# Altium project power_regulator.PrjPcb
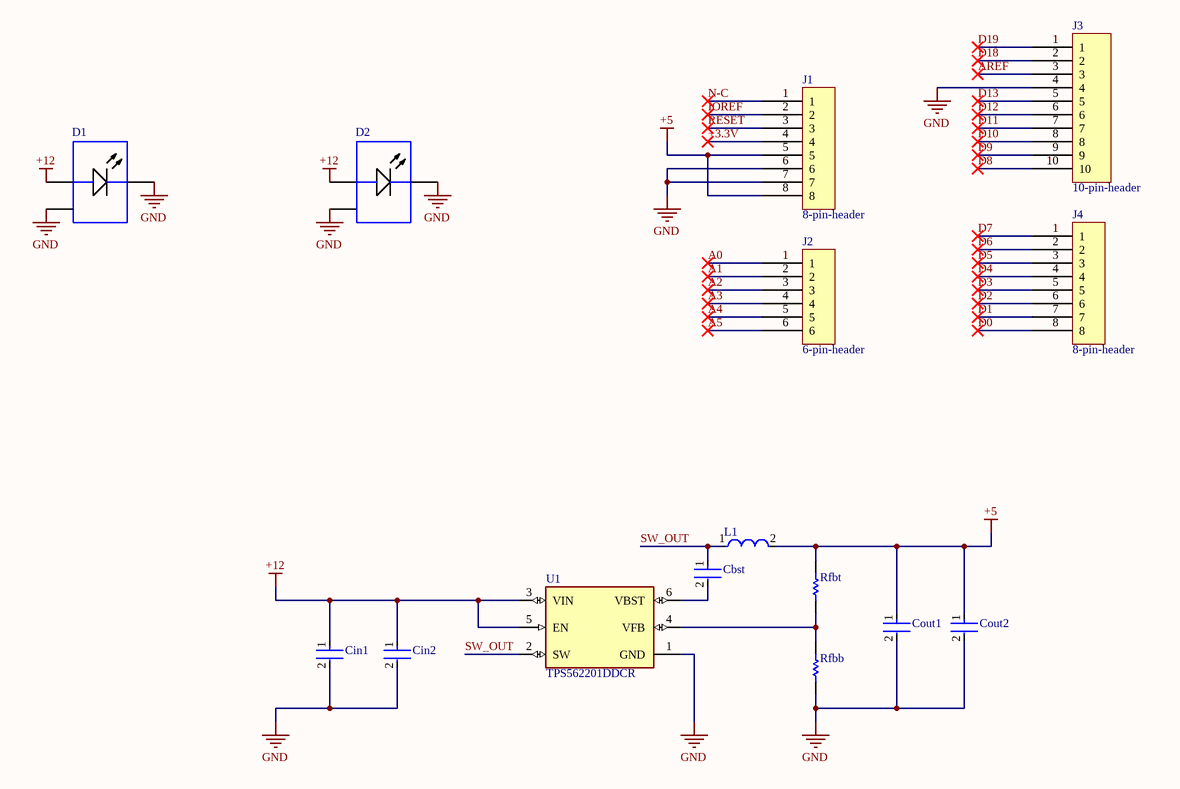
[diagram p0: Sheet1.SchDoc]
1 sheet, 15 parts. Net scope: global (net labels, ports and power ports of the same name join across sheets).
Board file: PCB1.PcbDoc

## Sheet Sheet1.SchDoc
size A4; DrawnBy: Ashok T; SheetNumber: 1; SheetTotal: 1

### Parts
Cbst  CL10B104KA8NFNC  [FP-CL10-IPC_C]  (value not drawn)
Cin1  CL21A106MPFNNNF  [FP-CL21-IPC_C]  (value not drawn)
Cin2  CL21A106MPFNNNF  [FP-CL21-IPC_C]  (value not drawn)
Cout1  12066D226MAT2A  [FP-1206-L_3_2_0_2-W_1_6_0-IPC_C]  (value not drawn)
Cout2  12066D226MAT2A  [FP-1206-L_3_2_0_2-W_1_6_0-IPC_C]  (value not drawn)
D1  MKRAWT-00-0000-0D0BJ20E5  [CREE-MK-R-2_V]  (value not drawn)
D2  MKRAWT-00-0000-0D0BJ20E5  [CREE-MK-R-2_V]  (value not drawn)
J1  8-pin-header  [8-pin-header-Footprint-1]
J2  6-pin-header  [6-pin-header-Footprint-1]
J3  10-pin-header  [10-pin-header-Footprint-1]
J4  8-pin-header  [8-pin-header-Footprint-1]
L1  NRS8030T3R3MJGJ  [FP-NRS8030-MFG]  (value not drawn)
Rfbb  ERJ2RKF1002X  [RESC1005X40X25LL05T05]  (value not drawn)
Rfbt  ERJ-2RKF5622X  [RESC1005X40X25LL05T05]  (value not drawn)
U1  TPS562201DDCR  [FP-DDC0006A-IPC_C]

### Nets
+5: Cout1.1 Cout2.1 J1.5 J1.8 L1.2 Rfbt.2
+12: Cin1.1 Cin2.1 D1.1(A) D2.1(A) U1.3(VIN) U1.5(EN)
GND: Cin1.2 Cin2.2 Cout1.2 Cout2.2 D1.2(K) D1.3(EP) D2.2(K) D2.3(EP) J1.6 J1.7 J3.4 Rfbb.1 U1.1(GND)
+3.3V: J1.4
A0: J2.1
A1: J2.2
A2: J2.3
A3: J2.4
A4: J2.5
A5: J2.6
AREF: J3.3
D0: J4.8
D1: J4.7
D2: J4.6
D3: J4.5
D4: J4.4
D5: J4.3
D6: J4.2
D7: J4.1
D8: J3.10
D9: J3.9
D10: J3.8
D11: J3.7
D12: J3.6
D13: J3.5
D18: J3.2
D19: J3.1
IOREF: J1.2
N-C: J1.1
RESET: J1.3
SW_OUT: Cbst.1 L1.1 U1.2(SW)
NetCbst_2: Cbst.2 U1.6(VBST)
NetRfbb_2: Rfbb.2 Rfbt.1 U1.4(VFB)

### Library data of the parts
Cbst = CMP-13271-001423-1: Cap Ceramic 100nF 25V X7R ±10% Pad SMD 0603 +125°C T/R; Depth: 0.8mm; Tolerance: 10%; Case Code (Imperial): 0603; Max Operating Temperature: 125°C; Min Operating Temperature: -55°C; Dielectric: X7R; Width: 0.031inch; Thickness: 0.035inch; Height: 0.8mm; Length: 1.6mm; Mount: Surface Mount; Capacitance: 100nF; Voltage Rating: 25V; Case Code (Metric): 1608; Case/Package: 0603; Radiation Hardening: No; Packaging: Tape and Reel
Cin1 Cin2 = CMP-13271-002245-1: CL21 Series 0805 10uF 10V ±20% Tolerance X5R Multilayer Ceramic Chip Capacitor; Voltage Rating (DC): 10V; Mount: Surface Mount; Tolerance: 20%; Case/Package: 0805; Voltage Rating: 10V; Dielectric: X5R; Max Operating Temperature: 85°C; Packaging: Tape and Reel; Capacitance: 10uF; Height: 1.25mm; Thickness: 0.053inch; Width: 0.049inch; Length: 2mm; Radiation Hardening: No; Min Operating Temperature: -55°C; Depth: 1.25mm; Package Quantity: 10000
Cout1 Cout2 = CMP-2000-05869-2: General Purpose Ceramic Capacitor, 1206, 22uF, 20%, X5R, 15%, 6.3V; Lead Free: Lead Free; Case Code (Metric): 3216; Case/Package: 1206; Depth: 1.6mm; Capacitance: 22uF; Length: 3.2mm; Series: -; Contact Plating: Tin; Tolerance: 20%; REACH SVHC: No SVHC; Radiation Hardening: No; RoHS Compliant: Yes; Termination: SMD/SMT; Voltage Rating: 6.3V; Packaging: Tape and Reel; Voltage: 6.3V; Mount: Surface Mount; Thickness: 0.07inch; Package Quantity: 1; Voltage Rating (DC): 6.3V; Case Code (Imperial): 1206; Construction: Flat; Dielectric: X5R; Number of Pins: 2; Min Operating Temperature: -55°C; Height: 0.07mm; Width: 0.063inch; Max Operating Temperature: 85°C
D1 = CMP-2100-01063-1: LED, White, 12 V, 2-Pin SMD, RoHS, Tape and Reel
D2 = CMP-2100-01063-1: LED, White, 12 V, 2-Pin SMD, RoHS, Tape and Reel; Manufacturer: Texas Instruments; Manufacturer Part Number: TPS562200DDCR; Package Body Material: Plastic; Throw Configuration: SWITCHING REGULATOR; Control Technique: PULSE WIDTH MODULATION; Max Supply Voltage: 17V; Min Input Voltage: 4.5V; Nominal Supply Voltage: 12V; Channels: 1; Max Output current: 4.3A; Switcher Configuration: BUCK; Frequency: 650kHz; Supplier: Mouser; Supplier Part Number: 595-TPS562200DDCR; RoHS: Yes; Category: Voltage Regulators - Switching; Stock: 26476; Pricing: 1=0.81, 10=0.668, 50=0.668, 100=0.506, 1000=0.345, 10000=0.279 (USD); Case/Package: TSSOP; Pins: 6; Package Shape: Rectangular; Terminal Finish: Tin; Min Operating Temperature: -40°C; Max Operating Temperature: 85°C; JESD-609 Code: e3; JESD-30 Code: R-PDSO-G6; Moisture Sensitivity Level: 1; Package Style: SMALL OUTLINE, THIN PROFILE, SHRINK PITCHMeter; Peak Reflow Temperature (Cel): 260°C; Surface Mount: Yes; Terminal Form: Gull Wing; Terminal Position: DUAL; Length: 2.9mm; Width: 1.6mm; Height - Seated (Max): 1.1mm; Terminal Pitch: 0.95mm; Temperature Grade: INDUSTRIAL; Reach SVHC Compliant: Yes; RoHS Compliant: Yes; ComponentLink1URL: https://www.ti.com:443/lit/ds/symlink/tps562200.pdf?src-supplier=IHS+Markit; ComponentLink1Description: https://www.ti.com:443/lit/ds/symlink/tps562200.pdf?src-supplier=IHS+Markit; ComponentLink2URL: https://datasheet.ciiva.com/29736/tps562200-29736871.pdf?src-supplier=Digi-Key; ComponentLink2Description: https://datasheet.ciiva.com/29736/tps562200-29736871.pdf?src-supplier=Digi-Key
J1 J4 = CMP-002-00072-1: 8 pin header for arduino
J2 = CMP-002-00071-2: 1x6 pin header for arduino
J3 = CMP-002-00073-1: 10 pin header for arduino
L1 = CMP-14484-000405-1: Inductor Power Shielded Wirewound 3.3uH 20% 100KHz Ferrite 4.2A 24.7mΩ DCR T/R; Current Rating: 4.3A; DC Resistance (DCR): 19mR; Self Resonant Frequency: 50MHz; Height: 3mm; Lead Free: Lead Free; Saturation Current: 4.2A; Termination: SMD/SMT; RoHS Compliant: Yes; Resistor Type: Wirewound; RMS Current (Irms): 4.3A; Series: NRS; Halogen Free: Halogen Free; Shielding: Shielded; Length: 8mm; Max DC Current: 4.2A; Height - Seated (Max): 0.118inch; Radiation Hardening: No; Min Operating Temperature: -25°C; Number of Pins: 2; Core Material: Ferrite; Inductance: 3.3uH; Package Quantity: 1000; REACH SVHC: No SVHC; Test Frequency: 100kHz; Tolerance: 20%; Case/Package: Nonstandard; Inductance Tolerance: 20%; Width: 0.315inch; Mount: Surface Mount; Depth: 8.2mm; Lead Pitch: 5.6mm; Packaging: Tape and Reel; Max Operating Temperature: 125°C
Rfbb = CMP-2000-07588-1: Chip Resistor, 10 KOhm, +/- 1%, 0.1 W, -55 to 155 degC, 0402 (1005 Metric), RoHS, Tape and Reel; Manufacturer: Panasonic; Power Rating: 100mW; Voltage Rating: 50V; Resistance: 10KOhm; Case\/Package: 0402; Temperature Coefficient: 100ppm\/degreesC; RoHSCompliant: True; Lead Free: LeadFree; Package Quantity: 1; Contact Plating: Tin; Length: 1mm; Radiation Hardening: No; REACH SVHC: NoSVHC; Max Operating Temperature: 155degC; Depth: 0.5mm; Case Code (Imperial): 0402; Military Standard: Not; Package Description: 2-Pin Surface Mount Device, Body 1 x 0.5 mm; Termination: SMD/SMT; Case Code (Metric): 1005; Height: 0.35mm; Packaging: TapeandReel; Voltage Rating (DC): 50V; Package Reference: 402; Number of Pins: 2; Tolerance: 1%; Mounting Technology: SurfaceMount; Width: 0.02inch; Mount: SurfaceMount; Datasheet URL: https://industrial.panasonic.com/cdbs/www-data/pdf/RDA0000/AOA0000C304.pdf; Composition: ThickFilm; Datasheet Version: 02/2017; Manufacturer URL: http://www.panasonic.com/; Max Power Dissipation: 100mW; Number of Terminations: 2; Min Operating Temperature: -55degC
Rfbt = CMP-2002-00996-1: Manufacturer: Panasonic; Part Number: ERJ-2RKF5622X
U1 = CMP-04918-000361-1: IC REG BUCK ADJ 2A TSOT23-6; Switching Frequency: 580kHz; Max Input Voltage: 17V; Number of Outputs: 1; Output Voltage: 7V; Output Type: Adjustable; Quiescent Current: 400uA; Min Input Voltage: 4.5V; Mount: Surface Mount; Max Operating Temperature: 125°C; Lead Free: Lead Free; Operating Supply Voltage: 17V; Number of Pins: 6; RoHS Compliant: Yes; Contact Plating: Tin; Min Operating Temperature: -40°C; Case/Package: SOT; Max Output Current: 2A